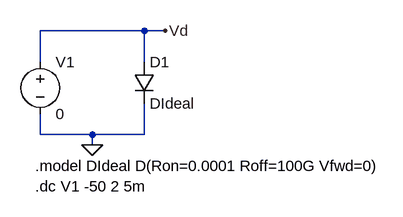
[diagram p0: schematic curva-vi_ideal.asc]
curva-vi_ideal.asc, the LTspice schematic file:
Version 4
SHEET 1 1012 680
WIRE 224 112 64 112
WIRE 256 112 224 112
WIRE 64 160 64 112
WIRE 224 160 224 112
WIRE 64 272 64 240
WIRE 144 272 64 272
WIRE 224 272 224 224
WIRE 224 272 144 272
WIRE 144 288 144 272
FLAG 256 112 Vd
FLAG 144 288 0
SYMBOL diode 208 160 R0
SYMATTR InstName D1
SYMATTR Value DIdeal
SYMBOL voltage 64 144 R0
SYMATTR InstName V1
SYMATTR Value 0
TEXT 56 352 Left 2 !.dc V1 -50 2 5m
TEXT 56 320 Left 2 !.model DIdeal D(Ron=0.0001 Roff=100G Vfwd=0)

The netlist it stands for:
* curva-vi_ideal.asc
D1 Vd 0 DIdeal
V1 Vd 0 0
.model D D
.lib standard.dio
.dc V1 -50 2 5m
.model DIdeal D(Ron=0.0001 Roff=100G Vfwd=0)
.backanno
.end